# EAGLE design CM FT4232 with RS485 and ESP32 (EAGLE 9.6.2)
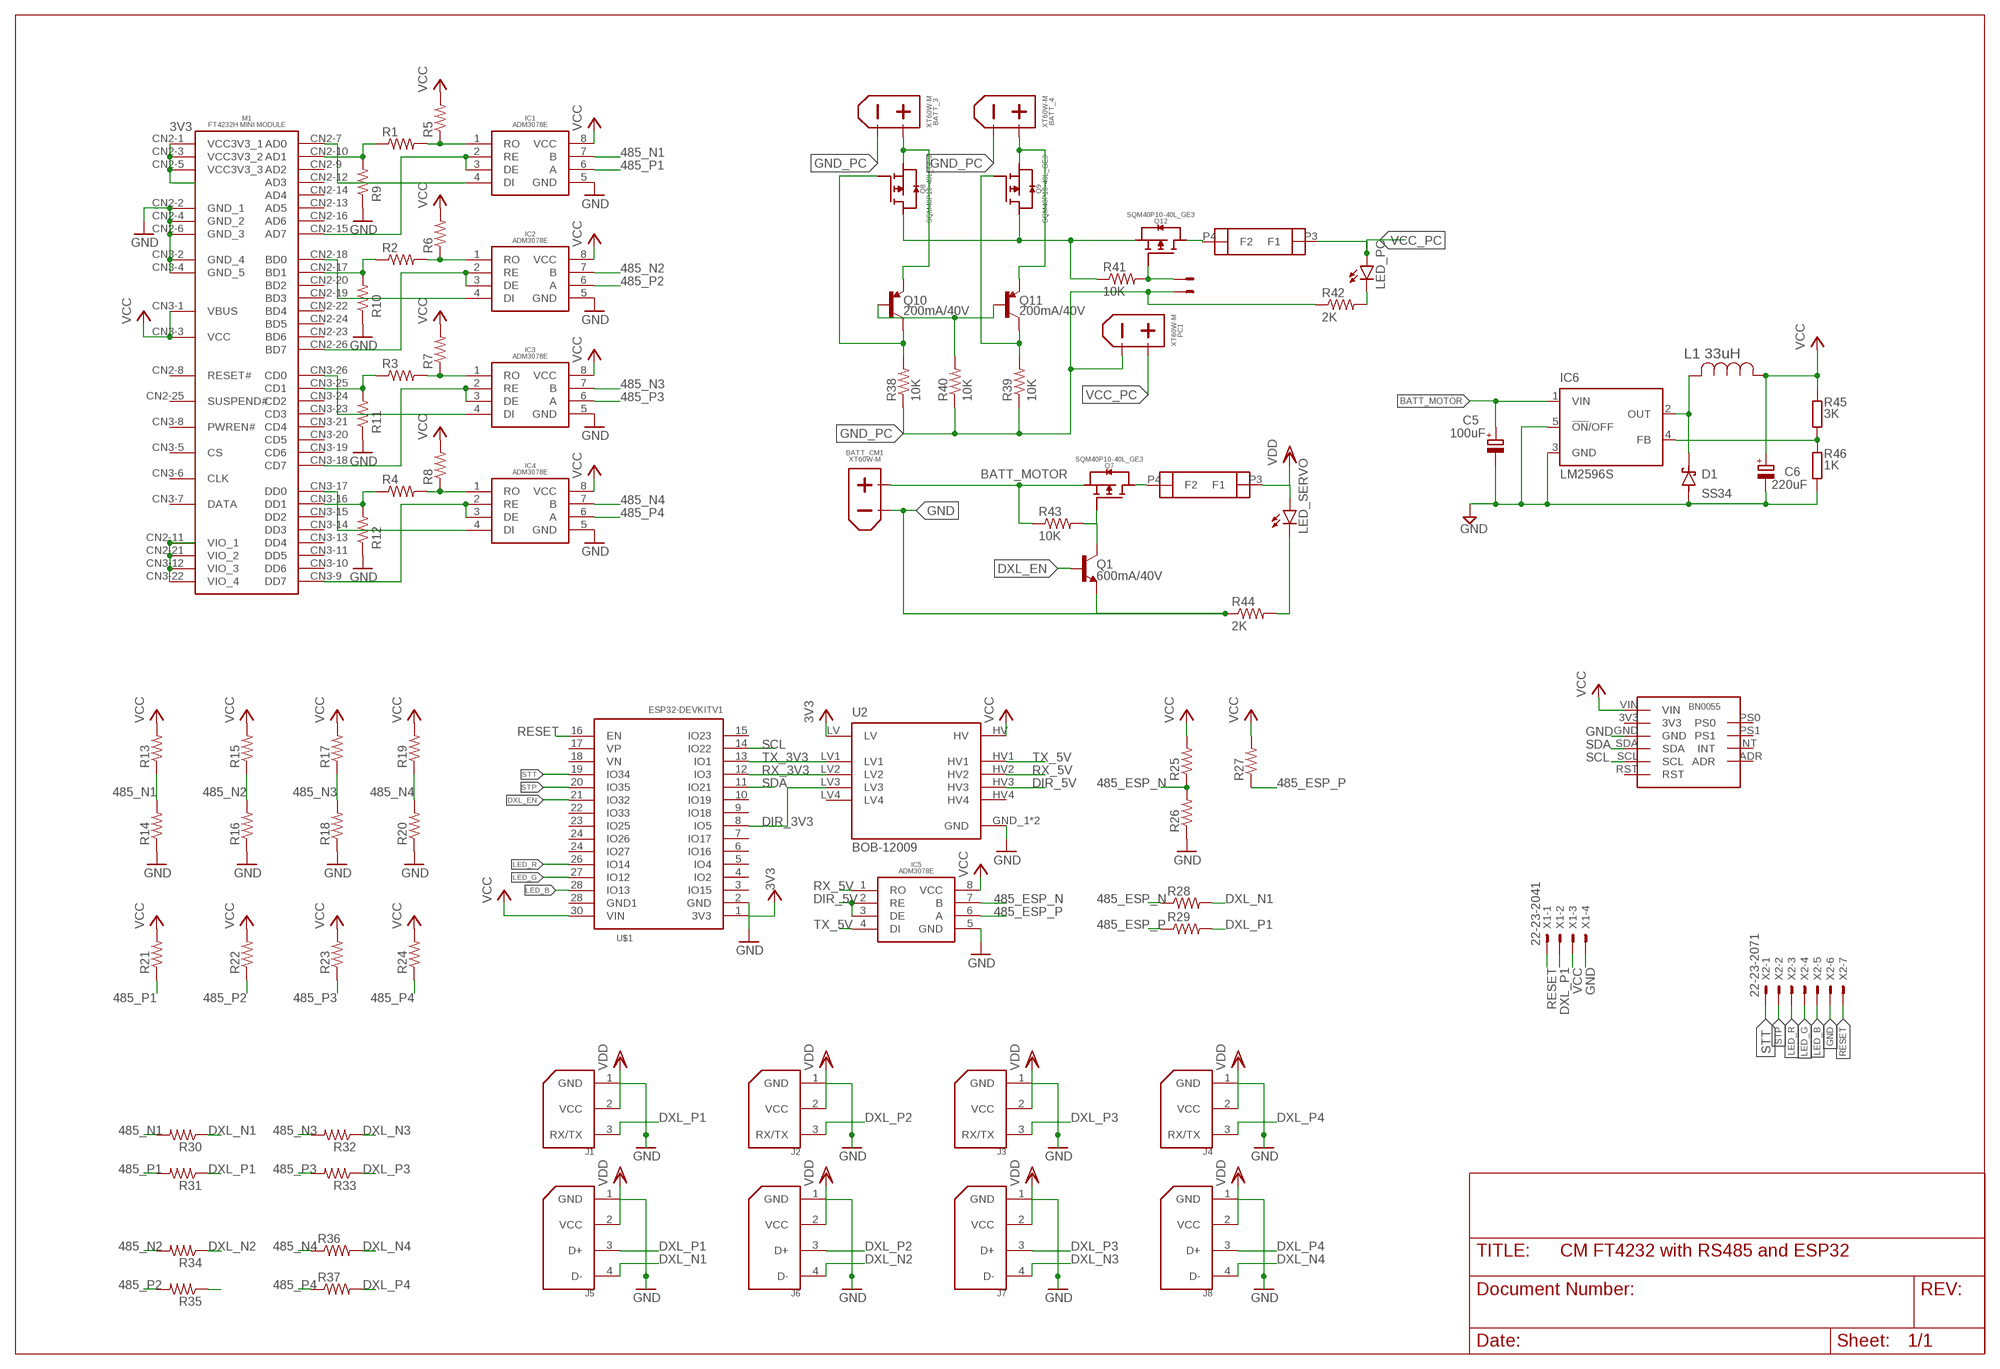
[diagram p0: schematic, sheet 1]

## Parts
BATT_3  XT60PW-M  [XT60PW-M]
BATT_4  XT60PW-M  [XT60PW-M]
BATT_CM1  XT60PW-M  [XT60PW-M]
C5  100uF  CPOL-EU153CLV-1010  [153CLV-1010]
C6  220uF  CPOL-EUUD-6,3X8,8  [UD-6,3X5,8_NICHICON]
D1  SS34  [DIOM6859X262N]
IC1  ADM3078E  [ADM3078E]
IC2  ADM3078E  [ADM3078E]
IC3  ADM3078E  [ADM3078E]
IC4  ADM3078E  [ADM3078E]
IC5  ADM3078E  [ADM3078E]
IC6  LM2596S  [TO263-5]
J1  22-03-5035  [5267-3]
J2  22-03-5035  [5267-3]
J3  22-03-5035  [5267-3]
J4  22-03-5035  [5267-3]
J5  22-03-5045  [5267-4]
J6  22-03-5045  [5267-4]
J7  22-03-5045  [5267-4]
J8  22-03-5045  [5267-4]
L1  33uH  CDRH127/LDNP-470MC  [IND_CDRH127/LDNP-470MC_SUM]
LED_PC  LEDCHIPLED_0805  [CHIPLED_0805]
LED_SERVO  LEDCHIPLED_0805  [CHIPLED_0805]
M1  FT4232H_MINI_MODULE  [FT4232H_MINI_MODULE]
PC1  XT60PW-M  [XT60PW-M]
Q1  600mA/40V  TRANS_NPN-MMBT2222AL  [SOT23-3]
Q7  SQM40P10-40L_GE3  [TO-252-3]
Q8  SQM40P10-40L_GE3  [TO-252-3]
Q9  SQM40P10-40L_GE3  [TO-252-3]
Q10  200mA/40V  TRANS_PNP-PMBT3906|MMBT3906L  [SOT23-3]
Q11  200mA/40V  TRANS_PNP-PMBT3906|MMBT3906L  [SOT23-3]
Q12  SQM40P10-40L_GE3  [TO-252-3]
R1  RESISTOR0805  [0805]
R2  RESISTOR0805  [0805]
R3  RESISTOR0805  [0805]
R4  RESISTOR0805  [0805]
R5  RESISTOR0805  [0805]
R6  RESISTOR0805  [0805]
R7  RESISTOR0805  [0805]
R8  RESISTOR0805  [0805]
R9  RESISTOR0805  [0805]
R10  RESISTOR0805  [0805]
R11  RESISTOR0805  [0805]
R12  RESISTOR0805  [0805]
R13  RESISTOR0805  [0805]
R14  RESISTOR0805  [0805]
R15  RESISTOR0805  [0805]
R16  RESISTOR0805  [0805]
R17  RESISTOR0805  [0805]
R18  RESISTOR0805  [0805]
R19  RESISTOR0805  [0805]
R20  RESISTOR0805  [0805]
R21  RESISTOR0805  [0805]
R22  RESISTOR0805  [0805]
R23  RESISTOR0805  [0805]
R24  RESISTOR0805  [0805]
R25  RESISTOR0805  [0805]
R26  RESISTOR0805  [0805]
R27  RESISTOR0805  [0805]
R28  RESISTOR0805  [0805]
R29  RESISTOR0805  [0805]
R30  RESISTOR0805  [0805]
R31  RESISTOR0805  [0805]
R32  RESISTOR0805  [0805]
R33  RESISTOR0805  [0805]
R34  RESISTOR0805  [0805]
R35  RESISTOR0805  [0805]
R36  RESISTOR0805  [0805]
R37  RESISTOR0805  [0805]
R38  10K  R-US_M0805  [M0805]
R39  10K  R-US_M0805  [M0805]
R40  10K  R-US_M0805  [M0805]
R41  10K  R-US_M0805  [M0805]
R42  2K  R-US_M0805  [M0805]
R43  10K  R-US_M0805  [M0805]
R44  2K  R-US_M0805  [M0805]
R45  3K  R-EU_R1206  [R1206]
R46  1K  R-EU_R1206  [R1206]
U2  BOB-12009  [CONV_BOB-12009]
U$1  ESP32DEVKITV1  [ESP32-DEVKITV1]
U$2  BNO055  [BNO055]
U$3  1808_FUSE_HOLDER  [1808_FUSE_HOLDER]
U$4  1808_FUSE_HOLDER  [1808_FUSE_HOLDER]
X1  22-23-2041  [22-23-2041]
X2  22-23-2071  [22-23-2071]
X8  22-23-2021  [22-23-2021]

## Nets
3V3: M1.CN2-1(VCC3V3_1) M1.CN2-3(VCC3V3_2) M1.CN2-5(VCC3V3_3) M1.CN2-11(VIO_1) M1.CN2-21(VIO_2) M1.CN3-12(VIO_3) M1.CN3-22(VIO_4) U2.LV U$1.1(3V3) ; supply symbol labelled VCC
485_ESP_N: IC5.7(B) R25.1 R26.2 R28.1
485_ESP_P: IC5.6(A) R27.1 R29.1
485_N1: IC1.7(B) R13.1 R14.2 R30.2
485_N2: IC2.7(B) R15.1 R16.2 R34.2
485_N3: IC3.7(B) R17.1 R18.2 R32.2
485_N4: IC4.7(B) R19.1 R20.2 R36.1
485_P1: IC1.6(A) R21.1 R31.2
485_P2: IC2.6(A) R22.1 R35.2
485_P3: IC3.6(A) R23.1 R33.2
485_P4: IC4.6(A) R24.1 R37.1
+3: Q8.4(D) Q9.4(D) Q12.3(S) R41.1
BATT_MOTOR: BATT_CM1.+ C5.+ IC6.1(VIN) Q7.3(S) R43.1
DI1: IC1.4(DI) M1.CN2-7(AD0)
DIR_3V3: U2.LV3 U$1.8(IO5)
DIR_5V: IC5.2(RE) IC5.3(DE) U2.HV3
DRAIN2: Q7.4(D) U$4.P4(F2)
DXL_EN: Q1.1(B) U$1.21(IO32)
DXL_N1: J5.4(D-) R28.2 R30.1
DXL_N2: J6.4(D-) R34.1
DXL_N3: J7.4(D-) R32.1
DXL_N4: J8.4(D-) R36.2
DXL_P1: J1.3(RX/TX) J5.3(D+) R29.2 R31.1 X1.2
DXL_P2: J2.3(RX/TX) J6.3(D+) R35.1
DXL_P3: J3.3(RX/TX) J7.3(D+) R33.1
DXL_P4: J4.3(RX/TX) J8.3(D+) R37.2
GND: BATT_CM1.1(-) BATT_CM1.2(-) BATT_CM1.- C5.- C6.- D1.A IC1.5(GND) IC2.5(GND) IC3.5(GND) IC4.5(GND) IC5.5(GND) IC6.3(GND) IC6.5(!ON!/OFF) J1.1(GND) J2.1(GND) J3.1(GND) J4.1(GND) J5.1(GND) J6.1(GND) J7.1(GND) J8.1(GND) M1.CN2-2(GND_1) M1.CN2-4(GND_2) M1.CN2-6(GND_3) M1.CN3-2(GND_4) M1.CN3-4(GND_5) Q1.2(E) R9.1 R10.1 R11.1 R12.1 R14.1 R16.1 R18.1 R20.1 R26.1 R44.1 R46.1 U2.GND_1(GND) U2.GND_2(GND) U$1.2(GND) U$2.GND X1.4 X2.6
GND_PC: BATT_3.1(-) BATT_3.2(-) BATT_3.- BATT_4.1(-) BATT_4.2(-) BATT_4.- PC1.1(-) PC1.2(-) PC1.- R38.1 R39.1 R40.1 R42.1 X8.2
LED_B: U$1.28(IO13) X2.5
LED_G: U$1.27(IO12) X2.4
LED_R: U$1.26(IO14) X2.3
N$2: IC2.2(RE) IC2.3(DE) M1.CN2-26(BD7)
N$3: IC3.2(RE) IC3.3(DE) M1.CN3-18(CD7)
N$4: IC4.2(RE) IC4.3(DE) M1.CN3-9(DD7)
N$5: M1.CN2-10(AD1) R1.1 R9.2
N$7: M1.CN2-17(BD1) R2.1 R10.2
N$8: IC2.1(RO) R2.2 R6.1
N$9: IC3.1(RO) R3.2 R7.1
N$10: M1.CN3-25(CD1) R3.1 R11.2
N$11: M1.CN3-16(DD1) R4.1 R12.2
N$12: IC4.1(RO) R4.2 R8.1
N$14: IC2.4(DI) M1.CN2-18(BD0)
N$15: IC3.4(DI) M1.CN3-26(CD0)
N$16: IC4.4(DI) M1.CN3-17(DD0)
N$17: BATT_3.+ Q8.3(S) Q10.2(E)
N$18: BATT_4.+ Q9.3(S) Q11.2(E)
N$19: Q8.1(G) Q10.3(C) R38.2
N$20: Q9.1(G) Q11.3(C) R39.2
N$22: Q10.1(B) Q11.1(B) R40.2
N$23: Q12.1(G) R41.2 X8.1
N$24: Q1.3(C) Q7.1(G) R43.2
N$25: LED_PC.C R42.2
N$26: LED_SERVO.C R44.2
N$27: IC6.4(FB) R45.1 R46.2
N$28: D1.C(K) IC6.2(OUT) L1.2
N$29: Q12.4(D) U$3.P4(F2)
RE1: IC1.2(RE) IC1.3(DE) M1.CN2-15(AD7)
RESET: U$1.16(EN) X1.1 X2.7
RO1: IC1.1(RO) R1.2 R5.1
RX_3V3: U2.LV2 U$1.12(IO3)
RX_5V: IC5.1(RO) U2.HV2
SCL: U$1.14(IO22) U$2.SCL
SDA: U$1.11(IO21) U$2.SDA
STP: U$1.20(IO35) X2.2
STT: U$1.19(IO34) X2.1
TX_3V3: U2.LV1 U$1.13(IO1)
TX_5V: IC5.4(DI) U2.HV1
VCC: C6.+ IC1.8(VCC) IC2.8(VCC) IC3.8(VCC) IC4.8(VCC) IC5.8(VCC) L1.1 M1.CN3-1(VBUS) M1.CN3-3(VCC) R5.2 R6.2 R7.2 R8.2 R13.2 R15.2 R17.2 R19.2 R21.2 R22.2 R23.2 R24.2 R25.2 R27.2 R45.2 U2.HV U$1.30(VIN) U$2.VIN X1.3
VCC_PC: LED_PC.A PC1.+ U$3.P3(F1)
VDD: J1.2(VCC) J2.2(VCC) J3.2(VCC) J4.2(VCC) J5.2(VCC) J6.2(VCC) J7.2(VCC) J8.2(VCC) LED_SERVO.A U$4.P3(F1)
Unconnected: M1.CN2-8(RESET#) M1.CN2-9(AD2) M1.CN2-12(AD3) M1.CN2-13(AD5) M1.CN2-14(AD4) M1.CN2-16(AD6) M1.CN2-19(BD3) M1.CN2-20(BD2) M1.CN2-22(BD4) M1.CN2-23(BD6) M1.CN2-24(BD5) M1.CN2-25(SUSPEND#) M1.CN3-5(CS) M1.CN3-6(CLK) M1.CN3-7(DATA) M1.CN3-8(PWREN#) M1.CN3-10(DD6) M1.CN3-11(DD5) M1.CN3-13(DD4) M1.CN3-14(DD3) M1.CN3-15(DD2) M1.CN3-19(CD6) M1.CN3-20(CD5) M1.CN3-21(CD4) M1.CN3-23(CD3) M1.CN3-24(CD2) U2.HV4 U2.LV4 U$1.3(IO15) U$1.4(IO2) U$1.5(IO4) U$1.6(IO16) U$1.7(IO17) U$1.9(IO18) U$1.10(IO19) U$1.15(IO23) U$1.17(VP) U$1.18(VN) U$1.22(IO33) U$1.23(IO25) U$1.24(IO26) U$1.24(IO27) U$1.28(GND1) U$2.3V3 U$2.ADR U$2.INT U$2.PS0 U$2.PS1 U$2.RST

## Library data of the parts
BATT_3 BATT_4 BATT_CM1 PC1 = AMASS_XT60:XT60PW-M
C5 C6 = rcl:CPOL-EU: POLARIZED CAPACITOR, European symbol; SPICEPREFIX: C
D1 = SS34:SS34: Check availability <https://pricing.snapeda.com/parts/SS34/Taiwan%20Semiconductor/view-part?ref=eda>; AVAILABILITY: In Stock; DESCRIPTION: 3A, 40V, Schottky Rectifier; MF: Taiwan Semiconductor; MP: SS34; PACKAGE: SMC-2 Taiwan Semiconductor; PRICE: None; PURCHASE-URL: https://pricing.snapeda.com/search/part/SS34/?ref=eda
IC1-IC5 = ADM3078E:ADM3078E
IC6 = national-semiconductor:LM2596: SIMPLE SWITCHER® Power Converter 150 kHz 3A Step-Down Voltage Regulator Source: http://www.national.com/ds/LM/LM2596.pdf; MF: NATIONAL SEMICONDUCTOR; MPN: LM2596S-ADJ/NOPB; OC_FARNELL: 9494367; OC_NEWARK: 41K3842
J1-J4 = molex:22-03-5035: Molex SPOX Vert, Tin (Dynamixel AX/MX Bus) tested: YES (arbotix)
J5-J8 = molex:22-03-5045: Molex SPOX Vert, Tin (Dynamixel RX Bus) tested: YES (arbotix2)
L1 = CDRH127_LDNP-470MC:CDRH127/LDNP-470MC: Check availability <https://pricing.snapeda.com/parts/CDRH127/LDNP-470MC/Sumida%20America/view-part?ref=eda>; AVAILABILITY: In Stock; DESCRIPTION: 47 µH Shielded - Inductor 3.25 A 78mOhm Max Nonstandard; MF: Sumida America; MP: CDRH127/LDNP-470MC; PACKAGE: Nonstandard Sumida; PRICE: None; PURCHASE-URL: https://pricing.snapeda.com/search/part/CDRH127/LDNP-470MC/?ref=eda
LED_PC LED_SERVO = led:LED: LED OSRAM: - CHIPLED LG R971, LG N971, LY N971, LG Q971, LY Q971, LO R971, LY R971 LH N974, LH R974 LS Q976, LO Q976, LY Q976 LO Q996 - Hyper CHIPLED LW Q18S LB Q993, LB Q99A, LB R99A - SideLED LS A670, LO A670, LY A670, LG A670, LP A670 LB A673, LV A673, LT A673, LW A673 LH A674 LY A675 LS A676, LA A676, LO A676, LY A676, LW A676 LS A679, LY A679, LG A679 - Hyper Micro SIDELED® LS Y876, LA Y876, LO Y876, LY Y876 LT Y87S - SmartLED LW L88C, LW L88S LB L89C, LB L89S, LG L890 LS L89K, LO L89K, LY L89K LS L896, LA L896, LO L896, LY L896 - TOPLED LS T670, LO T670, LY T670, LG T670, LP T670 LSG T670, LSP T670, LSY T670, LOP T670, LYG T670 LG T671, LOG T671, LSG T671 LB T673, LV T673, LT T673, LW T673 LH T674 LS T676, LA T676, LO T676, LY T676, LB T676, LH T676, LSB T676, LW T676 LB T67C, LV T67C, LT T67C, LS T67K, LO T67K, LY T67K, LW E67C LS E67B, LA E67B, LO E67B, LY E67B, LB E67C, LV E67C, LT E67C LW T67C LS T679, LY T679, LG T679 LS T770, LO T770, LY T770, LG T770, LP T770 LB T773, LV T773, LT T773, LW T773 LH T774 LS E675, LA E675, LY E675, LS T675 LS T776, LA T776, LO T776, LY T776, LB T776 LHGB T686 LT T68C, LB T68C - Hyper Mini TOPLED® LB M676 - Mini TOPLED Santana® LG M470 LS M47K, LO M47K, LY M47K Source: http://www.osram.convergy.de LUXEON: - LUMILED® LXK2-PW12-R00, LXK2-PW12-S00, LXK2-PW14-U00, LXK2-PW14-V00 LXK2-PM12-R00, LXK2-PM12-S00, LXK2-PM14-U00 LXK2-PE12-Q00, LXK2-PE12-R00, LXK2-PE12-S00, LXK2-PE14-T00, LXK2-PE14-U00 LXK2-PB12-K00, LXK2-PB12-L00, LXK2-PB12-M00, LXK2-PB14-N00, LXK2-PB14-P00, LXK2-PB14-Q00 LXK2-PR12-L00, LXK2-PR12-M00, LXK2-PR14-Q00, LXK2-PR14-R00 LXK2-PD12-Q00, LXK2-PD12-R00, LXK2-PD12-S00 LXK2-PH12-R00, LXK2-PH12-S00 LXK2-PL12-P00, LXK2-PL12-Q00, LXK2-PL12-R00 Source: www.luxeon.com KINGBRIGHT: KA-3528ASYC Source: www.kingbright.com
M1 = FT4232H_MINI_MODULE:FT4232H_MINI_MODULE
Q1 = SparkFun-DiscreteSemi:TRANS_NPN: NPN transistor Current controlled devices typically used to amplify current or used as a switch. BC547 - COM-08928 <http://www.sparkfun.com/products/8928> (TO-92 45V 100mA) (1.Collector 2.Base 3.Emitter) 2N3904 - COM-00521 <http://www.sparkfun.com/products/521> (TO-92 40V 200mA) (1.Emitter 2.Base 3.Collector) P2N2222A - COM-12852 <http://www.sparkfun.com/products/12852> (TO-92 40V 600mA) (1.Collector 2.Base 3.Emitter); PROD_ID: TRANS-08049
Q7-Q9 Q12 = Vishay_FET:SQM40P10-40L_GE3
Q10 Q11 = SparkFun-DiscreteSemi:TRANS_PNP: PNP transistor Current controlled devices typically used to amplify current or used as a switch. SparkFun Products: SparkFun Serial Enabled 16x2 LCD - Red on Black <https://www.sparkfun.com/products/9068> SparkFun Logomatic <https://www.sparkfun.com/products/12772>; PROD_ID: TRANS-08052
R1-R37 = SparkFun-Resistors:RESISTOR: Generic Resistor Package
R38-R44 = rcl:R-US_: RESISTOR, American symbol; SPICEPREFIX: R
R45 R46 = rcl:R-EU_: RESISTOR, European symbol; SPICEPREFIX: R
U2 = BOB-12009:BOB-12009: Logic Level Converter - Bi-Direc Check availability <https://pricing.snapeda.com/parts/BOB-12009/SparkFun/view-part?ref=eda>; AVAILABILITY: In Stock; DESCRIPTION: BSS138 Logic-Level Translator Interface Evaluation Board; MF: SparkFun; MP: BOB-12009; PACKAGE: None; PRICE: None; PURCHASE-URL: https://pricing.snapeda.com/search/part/BOB-12009/?ref=eda
U$1 = ESP32-DEVKITV1:ESP32DEVKITV1
U$2 = BNO055:BNO055
U$3 U$4 = 1808_Fuse_Holder:1808_FUSE_HOLDER
X1 = con-molex:22-23-2041: .100" (2.54mm) Center Header - 4 Pin; MF: MOLEX; MPN: 22-23-2041; OC_FARNELL: 1462920; OC_NEWARK: 38C0355
X2 = con-molex:22-23-2071: .100" (2.54mm) Center Header - 7 Pin; MF: MOLEX; MPN: 22-23-2071; OC_FARNELL: 1654534; OC_NEWARK: 56H0445
X8 = con-molex:22-23-2021: .100" (2.54mm) Center Header - 2 Pin; MF: MOLEX; MPN: 22-23-2021; OC_FARNELL: 1462926; OC_NEWARK: 25C3832

## Net classes
4 Battery-Power: width 2.54 mm, drill 1.27 mm, clearance 0.203 mm

## Board
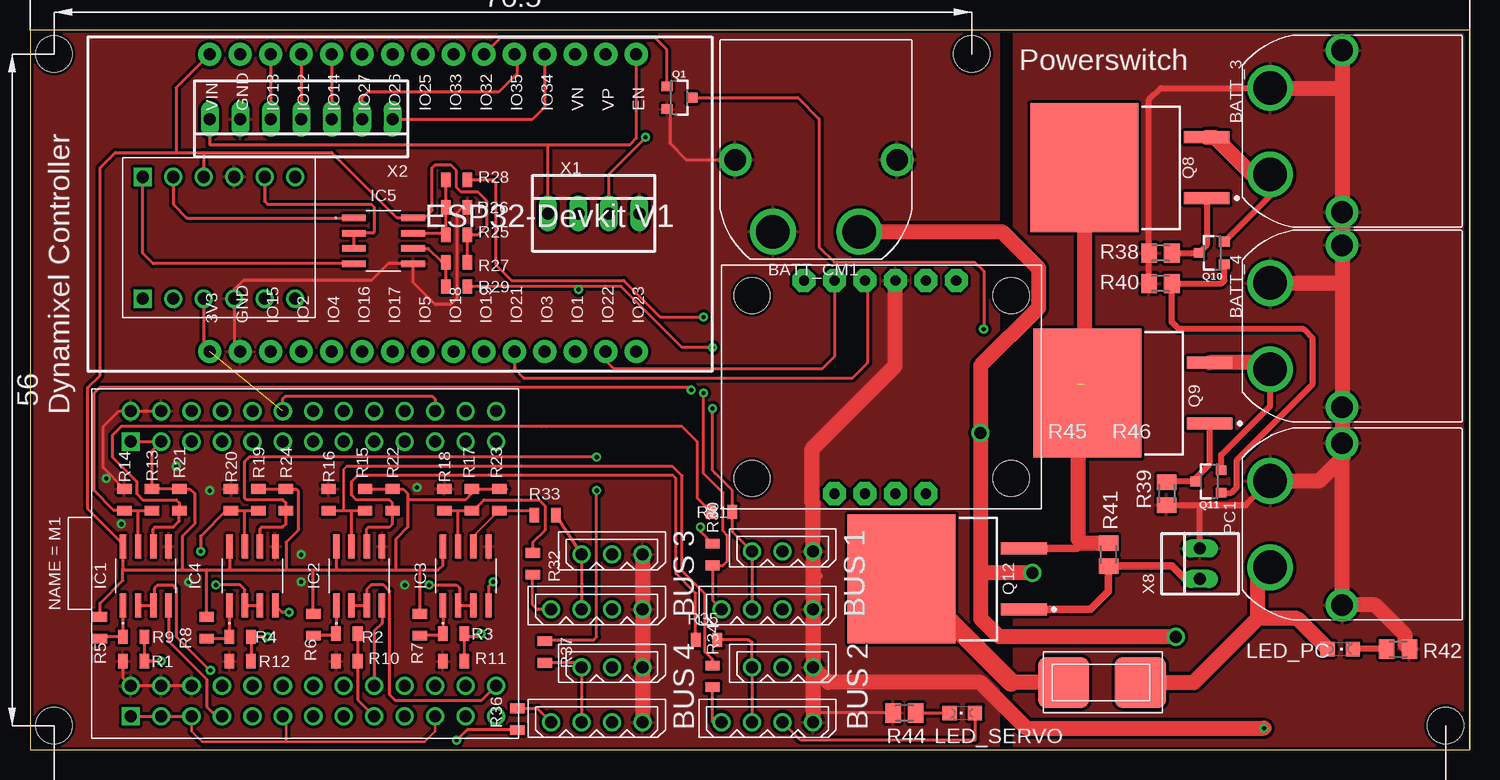
[diagram p1: board, top side]
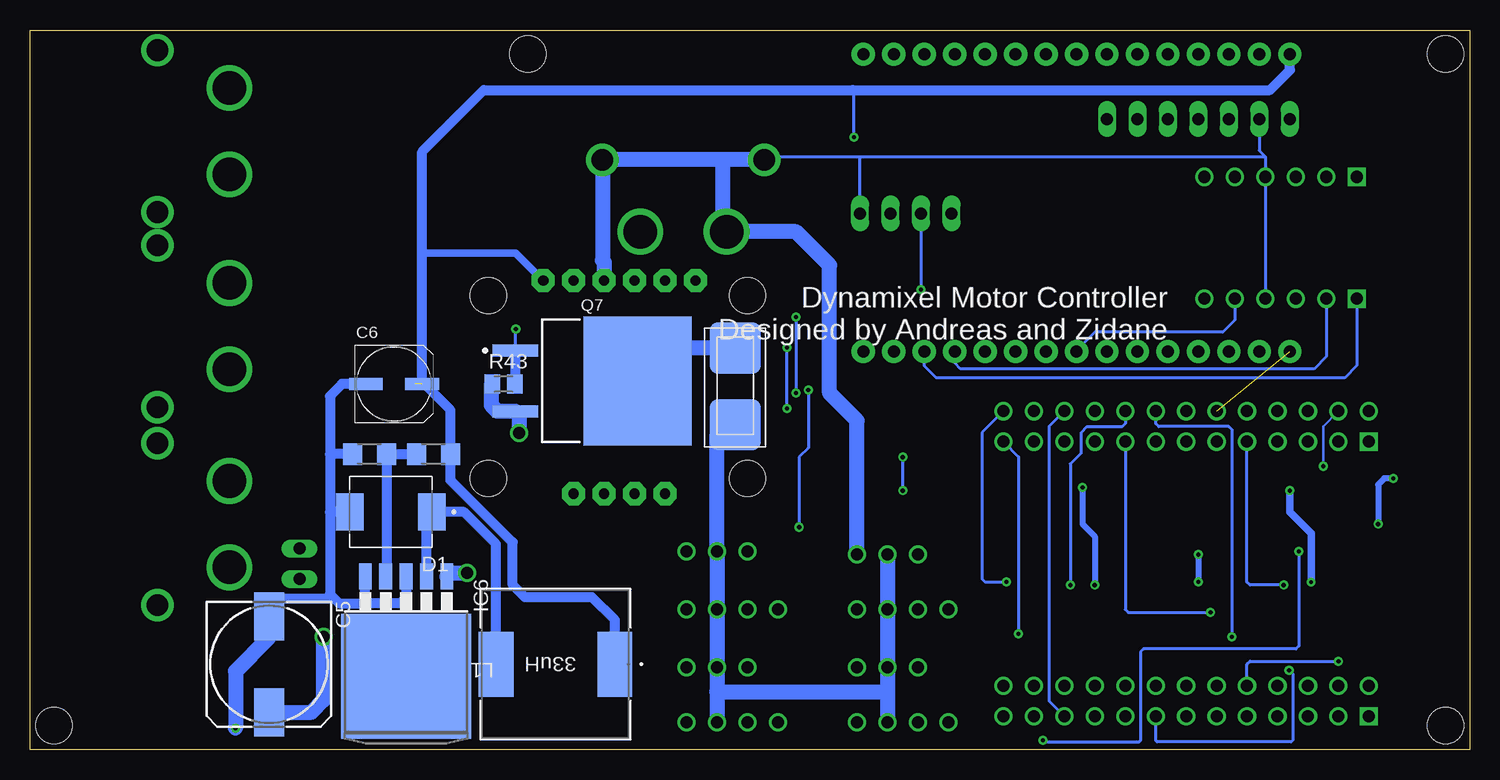
[diagram p2: board, bottom side, seen from below]

Size 120 x 60 mm. Coordinates in mm from the lower left corner, seen from the top.
Outline: 0,0 120,0 120,60 0,60 0,0
Copper layers (1*16): Top 0.035mm / dielectric 1.5mm / Bottom 0.035mm
Design rules "default *": minimum track width 6mil, minimum drill 0.35mm, track to track 10mil, track to pad 10mil, pad to pad 10mil, via to via 10mil, smd to smd 10mil, copper to edge 10mil, drill to drill 6mil, minimum pad ring 10mil, minimum via ring 8mil, stop-mask expansion 4mil, vias tented up to drill 0mil, thermal gap 10mil
Holes 3 mm at 118,2 2,2 2,58 78.5,58

### Footprints (pad centres in the part's own frame; a part is rotated, then mirrored left to right if it is on the bottom)
XT60PW-M = drill 1.8: 1 -6.75,-10; 2 6.75,-10 | drill 2.8: + 3.6,-16; - -3.6,-16
153CLV-1010 = smd 4 x 2.5: + 4,0; - -4,0
UD-6,3X5,8_NICHICON = smd 2.8 x 1: + 2.35,0; - -2.35,0
DIOM6859X262N = smd 2.29 x 3.12: A 3.43,0; C -3.43,0
ADM3078E = smd 1.981 x 0.533: 1 -2.464,1.905; 2 -2.464,0.635; 3 -2.464,-0.635; 4 -2.464,-1.905; 5 2.464,-1.905; 6 2.464,-0.635; 7 2.464,0.635; 8 2.464,1.905
TO263-5 = smd 1.067 x 2.159: 1 -3.404,-5.791; 2 -1.702,-5.791; 3 0,-5.791; 4 1.702,-5.791; 5 3.404,-5.791 | smd 10.8 x 10.41: 6 0,2.54
5267-3 = drill 1: 1 0,0; 2 -2.54,0; 3 -5.08,0
5267-4 = drill 1: 1 0,0; 2 -2.54,0; 3 -5.08,0; 4 -7.62,0
IND_CDRH127/LDNP-470MC_SUM = smd 2.896 x 5.41: 1 -4.953,0; 2 4.953,0
CHIPLED_0805 = smd 1.2 x 1.2: A 0,-1.05; C 0,1.05
FT4232H_MINI_MODULE = drill 1 square: CN2-1 -12.715,16.51; CN3-1 10.175,16.51 | drill 1: CN2-2 -10.175,16.51; CN2-3 -12.715,13.97; CN2-4 -10.175,13.97; CN2-5 -12.715,11.43; CN2-6 -10.175,11.43; CN2-7 -12.715,8.89; CN2-8 -10.175,8.89; CN2-9 -12.715,6.35; CN2-10 -10.175,6.35; CN2-11 -12.715,3.81; CN2-12 -10.175,3.81; CN2-13 -12.715,1.27; CN2-14 -10.175,1.27; CN2-15 -12.715,-1.27; CN2-16 -10.175,-1.27; CN2-17 -12.715,-3.81; CN2-18 -10.175,-3.81; CN2-19 -12.715,-6.35; CN2-20 -10.175,-6.35; CN2-21 -12.715,-8.89; CN2-22 -10.175,-8.89; CN2-23 -12.715,-11.43; CN2-24 -10.175,-11.43; CN2-25 -12.715,-13.97; CN2-26 -10.175,-13.97; CN3-2 12.715,16.5; CN3-3 10.175,13.97; CN3-4 12.715,13.97; CN3-5 10.175,11.43; CN3-6 12.715,11.43; CN3-7 10.175,8.89; CN3-8 12.715,8.89; CN3-9 10.175,6.35; CN3-10 12.715,6.35; CN3-11 10.175,3.81; CN3-12 12.715,3.81; CN3-13 10.175,1.27; CN3-14 12.715,1.27; CN3-15 10.175,-1.27; CN3-16 12.715,-1.27; CN3-17 10.175,-3.81; CN3-18 12.715,-3.81; CN3-19 10.175,-6.35; CN3-20 12.715,-6.35; CN3-21 10.175,-8.89; CN3-22 12.715,-8.89; CN3-23 10.175,-11.43; CN3-24 12.715,-11.43; CN3-25 10.175,-13.97; CN3-26 12.715,-13.97
SOT23-3 = smd 0.8 x 0.9: 1 -0.95,-1; 2 0.95,-1; 3 0,1.1
TO-252-3 = smd 3.8 x 1: 1 -6.4,2.54; 3 -6.4,-2.54 | smd 9 x 10.75: 4 3.8,0
0805 = smd 0.8 x 1.2: 1 -0.9,0; 2 0.9,0
M0805 = smd 1.3 x 1.6: 1 -0.95,0; 2 0.95,0
R1206 = smd 1.6 x 1.803: 1 -1.422,0; 2 1.422,0
CONV_BOB-12009 = drill 1.016: GND_1 5.08,-1.27; GND_2 -5.08,-1.27; HV 5.08,1.27; HV2 5.08,3.81; HV3 5.08,-3.81; HV4 5.08,-6.35; LV -5.08,1.27; LV2 -5.08,3.81; LV3 -5.08,-3.81; LV4 -5.08,-6.35 | drill 1.016 square: HV1 5.08,6.35; LV1 -5.08,6.35
ESP32-DEVKITV1 = drill 1 pad 1.93: 1 -22.87,-13.54; 2 -20.33,-13.54; 3 -17.79,-13.54; 4 -15.25,-13.54; 5 -12.71,-13.54; 6 -10.17,-13.54; 7 -7.63,-13.54; 8 -5.09,-13.54; 9 -2.55,-13.54; 10 -0.01,-13.54; 11 2.53,-13.54; 12 5.07,-13.54; 13 7.61,-13.54; 14 10.15,-13.54; 15 12.69,-13.54; 16 12.69,11.23; 17 10.15,11.23; 18 7.61,11.23; 19 5.07,11.23; 20 2.53,11.23; 21 -0.01,11.23; 22 -2.55,11.23; 23 -5.09,11.23; 24 -7.63,11.23; 25 -10.17,11.23; 26 -12.71,11.23; 27 -15.25,11.23; 28 -17.79,11.23; 29 -20.33,11.23; 30 -22.87,11.23
BNO055 = drill 0.85 pad 1.93 octagon: 3V3 9.652,1.27; ADR 17.272,19.05; GND 12.192,1.27; INT 14.732,19.05; PS0 9.652,19.05; PS1 12.192,19.05; RST 19.812,1.27; SCL 17.272,1.27; SDA 14.732,1.27; VIN 7.112,1.27 | hole 3: 2.54,2.54; 2.54,17.78; 24.13,2.54; 24.13,17.78
1808_FUSE_HOLDER = smd 4.242 x 4.242: P3 -3.15,0; P4 3.251,0
22-23-2041 = drill 1 long: 1 -3.81,0; 2 -1.27,0; 3 1.27,0; 4 3.81,0
22-23-2071 = drill 1 long: 1 -7.62,0; 2 -5.08,0; 3 -2.54,0; 4 0,0; 5 2.54,0; 6 5.08,0; 7 7.62,0
22-23-2021 = drill 1 long: 1 -1.27,0; 2 1.27,0

### Placement (x,y rotation side)
BATT_3  119.38,51.56 270 top
BATT_4  119.38,35.31 270 top
BATT_CM1  65.53,59.18 0 top
C5  100.08,7.11 270 bottom
C6  89.66,30.48 0 bottom
D1  89.92,19.81 180 bottom
IC1  9.65,14.48 90 top
IC2  27.43,14.48 90 top
IC3  36.32,14.48 90 top
IC4  18.54,14.48 90 top
IC5  29.46,42.42 0 top
IC6  88.65,8.64 180 bottom
J1  65.28,16.51 0 top
J2  65.28,6.86 0 top
J3  51.05,16.26 0 top
J4  51.05,6.86 0 top
J5  65.28,11.68 0 top
J6  65.28,2.29 0 top
J7  51.05,11.68 0 top
J8  51.05,2.29 0 top
L1  76.2,7.11 180 bottom
LED_PC  109.22,8.38 270 top
LED_SERVO  77.72,3.05 90 top
M1  24.89,15.49 90 top
PC1  119.38,18.8 270 top
Q1  54.1,54.36 270 top
Q7  73.15,30.73 0 bottom
Q8  91.69,48.51 180 top
Q9  91.95,29.72 180 top
Q10  98.55,41.4 90 top
Q11  98.3,22.35 90 top
Q12  76.45,14.22 180 top
R1  8.64,9.4 180 top
R2  26.42,9.65 180 top
R3  35.31,9.65 180 top
R4  17.53,9.4 180 top
R5  5.84,10.16 90 top
R6  23.62,10.41 90 top
R7  32.51,10.41 90 top
R8  14.73,10.16 90 top
R9  8.64,7.37 0 top
R10  26.42,7.37 0 top
R11  35.31,7.37 0 top
R12  17.53,7.37 0 top
R13  10.16,20.83 90 top
R14  7.87,20.83 270 top
R15  27.94,20.83 90 top
R16  24.89,20.83 270 top
R17  36.83,20.83 90 top
R18  34.54,20.83 270 top
R19  19.05,20.83 90 top
R20  16.76,20.83 270 top
R21  12.45,20.83 90 top
R22  30.23,20.83 90 top
R23  39.12,20.83 90 top
R24  21.34,20.83 90 top
R25  35.56,42.93 0 top
R26  35.56,45.21 180 top
R27  35.56,40.64 0 top
R28  35.56,47.5 0 top
R29  35.56,38.61 0 top
R30  56.9,16.26 90 top
R31  57.66,19.81 180 top
R32  41.91,15.49 90 top
R33  42.93,19.56 180 top
R34  56.9,6.1 90 top
R35  56.39,9.14 180 top
R36  40.64,2.54 90 top
R37  42.93,8.13 270 top
R38  94.23,41.4 0 top
R39  94.74,21.34 90 top
R40  94.23,38.86 0 top
R41  89.92,16.26 270 top
R42  114.05,8.38 180 top
R43  80.52,30.48 0 bottom
R44  72.9,3.05 0 top
R45  86.36,24.64 0 bottom
R46  91.69,24.64 0 bottom
U2  15.75,42.67 90 top
U$1  37.85,46.74 0 top
U$2  84.33,40.39 180 top
U$3  89.41,5.59 180 top
U$4  61.21,30.23 90 bottom
X1  46.99,44.7 0 top
X2  22.61,52.58 180 top
X8  97.54,15.49 90 top

### Tracks (layer width: path | path; a pad name or v marks a point on that pad's centre or on a via)
3V3  (1 unrouted)
  Top 0.203: M1.CN2-5 13.46,1.52 14.35,0.64 21.34,0.64 | 21.34,0.64 32.89,0.64 33.78,1.52 M1.CN2-21 | M1.CN2-11 21.34,2.52 21.34,0.64
  Top 0.254: M1.CN2-1 M1.CN2-3 M1.CN2-5 | M1.CN3-12 21.08,29.21 21.34,29.46 33.53,29.46 33.78,29.21 M1.CN3-22 | U$1.1 14.47,33.7 14.47,37.58 U2.LV
  Bottom 0.254: M1.CN3-22 35.05,26.94 35.05,4.05 M1.CN2-21
485_ESP_N
  Top 0.254: 34.66,43.05 R25.1 | IC5.7 34.66,43.05 | R28.1 R26.2 34.66,43.05
485_ESP_P
  Top 0.254: IC5.6 33.2,41.78 34.34,40.64 R27.1 R29.1
485_N1  (via drill 0.35)
  Top 0.254: 8.89,19.93 R14.2 7,19.93 5.33,21.59 5.33,29.72 5.84,30.23 54.86,30.23 v55.12,29.97 | 8.89,19.93 R13.1 | IC1.7 9.02,19.8 8.89,19.93 | v55.88,18.54 55.88,18.17 R30.2
  Bottom 0.254: v55.12,29.97 55.12,25.15 55.88,24.38 v55.88,18.54
485_N2
  Top 0.203: 26.16,19.93 26.16,23.37 26.42,23.62
  Top 0.254: R16.2 26.16,19.93 26.92,19.93 | 26.92,19.93 R15.1 | IC2.7 26.8,19.8 26.92,19.93 | R34.2 56.9,7.5 56.27,8.13 56.27,12.97 54.36,14.88 54.36,22.81 53.55,23.62 26.42,23.62
485_N3
  Top 0.254: R18.2 35.81,19.93 | 35.81,19.93 R17.1 36.95,19.93 37.85,20.83 42.42,20.83 42.93,20.32 42.93,18.29 41.91,17.27 R32.2 | IC3.7 35.69,19.8 35.81,19.93
485_N4  (via drill 0.35)
  Top 0.254: 18.03,19.93 R20.2 16.37,19.93 14.22,17.78 v14.22,16.51 | 18.03,19.93 R19.1 | IC4.7 17.91,19.8 18.03,19.93 | R36.1 36.44,1.64 v35.56,0.76
  Bottom 0.254: v14.22,16.51 14.22,8.64 14.48,8.38 27.18,8.38 27.43,8.13 27.43,0.76 27.56,0.64 35.43,0.64 v35.56,0.76
485_P1
  Top 0.254: IC1.6 10.29,18.41 10.41,18.54 11.94,18.54 12.45,19.05 R21.1 12.45,20.57 12.19,20.83 9.4,20.83 8.89,21.34 8.89,22.35 6.86,24.38 6.86,26.19 7.59,26.92 42.67,26.92 43.02,26.92 54.36,26.92 55.63,25.65 55.63,20.94 R31.2
485_P2
  Top 0.254: IC2.6 28.07,18.41 28.19,18.54 29.97,18.54 30.23,18.8 R22.1 30.23,20.57 29.97,20.83 27.18,20.83 26.8,21.21 26.8,22.35 27.3,22.86 53.59,22.86 53.85,22.6 53.85,14.67 55.49,13.03 R35.2
485_P3
  Top 0.203: IC3.6 36.96,17.77 R23.1
  Top 0.254: R23.1 41.66,19.93 R33.2
485_P4  (via drill 0.35)
  Top 0.254: IC4.6 19.18,18.41 19.3,18.54 21.08,18.54 21.34,18.8 R24.1 21.34,20.57 21.08,20.83 18.03,20.83 17.91,20.95 17.91,24 18.16,24.26 18.29,24.38 v47.24,24.38 | R37.1 43.04,9.14 46.99,9.14 47.24,9.4 v47.24,21.59
  Bottom 0.254: v47.24,21.59 v47.24,24.38
+3
  Top 0.152: Q9.4 87.88,29.72 87.38,30.23
  Top 0.61: Q12.3 87.25,16.76 87.7,17.21
  Top 1.27: Q8.4 87.89,31.24 | 87.89,31.24 87.89,29.97 Q9.4 | 87.89,31.24 88.15,31.5 88.65,31.5 87.38,30.23 87.38,17.53 87.7,17.21 R41.1
BATT_MOTOR  (via drill 1)
  Top 1.27: v95.5,9.4 80.77,9.4 79.25,10.92 79.25,14.73 | 79.25,14.73 v79.25,26.42 79.25,32 84.07,36.83 84.07,40.13 81.02,43.18 BATT_CM1.+ | v83.57,14.73 79.25,14.73
  Bottom 1.27: C5.+ 96.52,3.11 95.5,4.13 v95.5,9.4 | IC6.1 84.94,14.73 v83.57,14.73 | v79.25,26.42 79.25,27.89 Q7.3 81.03,28.19 81.53,28.7 81.53,30.41 R43.1
DI1
  Top 0.254: IC1.4 11.56,9.02 14.73,5.84 14.73,3.56 15.51,2.78 M1.CN2-7
DIR_3V3
  Bottom 0.254: U2.LV3 19.56,35.81 20.57,34.8 31.24,34.8 32.76,33.28 U$1.8
DIR_5V
  Top 0.254: U2.HV3 19.56,45.72 19.81,45.47 28.45,45.47 28.7,45.21 28.7,43.18 28.57,43.05 IC5.2 IC5.3
DRAIN2
  Bottom 1.27: U$4.P4 65.84,33.48 69.09,30.23 69.35,30.49 Q7.4
DXL_EN
  Top 0.254: Q1.1 53.1,58.35 52.09,59.37 39.24,59.37 U$1.21
DXL_N1  (via drill 0.35)
  Top 0.254: J5.4 56.9,12.45 R30.1 57.77,15.36 58.17,15.75 58.17,17.82 57.78,18.21 57.78,21.4 56.14,23.04 v56.14,29.72 | R28.2 38.61,47.5 38.86,47.24 38.86,40.39 40.13,39.12 49.49,39.12 52.53,36.07 v56.13,36.07
  Bottom 0.254: v56.13,36.07 v56.13,29.72 v56.14,29.72
DXL_N2
  Top 0.254: J6.4 56.9,2.29 R34.1
DXL_N3
  Top 0.254: J7.4 42.28,11.68 41.91,12.05 R32.1
DXL_N4
  Top 0.254: R36.2 42.28,3.44 J8.4
DXL_P1  (via drill 0.35)
  Top 0.254: J5.3 J1.3 58.56,18.15 R31.1 58.56,21.59 57.09,23.06 56.9,23.25 v56.9,28.45 | 45.72,38.61 49.28,38.61 54.36,33.53 v56.9,33.53 | 45.72,38.61 R29.2 | v45.72,38.36 45.72,38.61
  Bottom 0.254: v56.9,28.45 v56.9,33.53 | X1.2 v45.72,38.36
DXL_P2
  Top 0.254: R35.1 59.81,9.14 60.2,8.95 J2.3 J6.3
DXL_P3
  Top 0.254: R33.1 J3.3 J7.3
DXL_P4
  Top 0.254: R37.2 45.6,7.23 J4.3 J8.3
GND  (via drill 0.3, 0.35)
  Top 0.254: M1.CN2-6 M1.CN2-4 M1.CN2-2 7.74,5.96 R9.1 | M1.CN3-4 M1.CN3-2 7.38,28.21 6.1,26.92 6.1,23.51 R14.1 | 17.01,37.58 17.01,33.7 U$1.2 | 17.01,37.58 U2.GND_2 | 17.01,37.58 17.01,38.34 17.78,39.12 28.45,39.12 29.84,40.51 IC5.5 31.93,38.94 33.78,37.08 35.05,37.08 35.56,37.59 35.56,44.7 36.07,45.21 R26.1 | Q1.2 53.34,53.17 53.34,50.55 54.7,49.18 BATT_CM1.1 | R44.1 65.53,3.05 65.28,3.3
  Top 0.61: 65.79,14.48 65.28,13.97
  Top 1.27: J2.1 J5.1 65.28,13.97 J1.1 65.28,20.49 65.2,20.57 65.2,25.07 72.14,32 U$2.GND | J2.1 65.28,3.3 J6.1 | J3.1 J7.1 J4.1 J8.1 | J2.1 66.55,5.59 79.25,5.59 83.06,1.78 v102.87,1.78
  Bottom 0.203: M1.CN3-4 12.19,26.94 v12.19,23.62
  Bottom 0.254: U2.GND_2 U2.GND_1 17.02,49.44 | 50.8,49.44 58.53,49.44 BATT_CM1.1 | 50.8,49.44 17.02,49.44 | X2.6 17.53,49.94 17.02,49.44 | X1.4 50.8,49.44
  Bottom 0.508: v22.61,16.26 v22.61,13.97 | v32.26,21.84 32.26,18.8 31.24,17.78 v31.24,13.72 | v6.35,22.61 7.11,22.61 7.62,22.1 v7.62,18.8
  Bottom 0.61: BATT_CM1.2 72.28,49.02 | 72.28,39.26 U$2.GND | v14.99,21.59 14.99,19.81 13.21,18.03 v13.21,13.97
  Bottom 0.813: IC6.3 88.65,12.7 89.15,12.19 91.95,12.19 | 91.95,12.19 92.05,12.29 IC6.5 | C6.- 93.98,30.48 95,29.46 95,24.64 | 91.95,12.19 94.23,12.19 94.61,12.57 | 95,24.64 95,19.81 | 95,19.81 95,12.95 94.61,12.57 | 94.61,12.57 99.69,12.57 100.33,11.94 100.33,11.37 C5.- | D1.A 95,19.81 | R46.1 95,24.64
  Bottom 1.27: BATT_CM1.1 62.23,49.18 | 62.23,49.18 72.12,49.18 72.28,49.02 | 62.23,49.18 62.23,43.48 BATT_CM1.- 56.14,43.18 53.34,40.39 53.34,29.72 51.05,27.43 J3.1 | BATT_CM1.2 72.28,40.79 72.14,40.64 72.14,39.41 72.28,39.26 | C5.- 100.08,9.33 102.87,6.54 v102.87,1.78
  pour Top: 0,59.94 80.77,59.94 80.77,0.25 0,0.25
GND_PC
  Top 0.508: R39.1 97.54,20.39 | 97.54,20.39 101.37,20.39 PC1.- | X8.2 97.54,20.39 | R40.1 R38.1 93.28,54.17 94.28,55.16 BATT_3.-
  Top 1.27: BATT_3.1 109.38,55.12 | 109.38,55.12 BATT_3.2 BATT_4.1 109.38,38.61 | 109.38,38.61 BATT_4.2 PC1.1 | PC1.- 107.49,22.4 109.47,24.38 109.47,25.15 109.38,25.24 PC1.1 | BATT_4.- 109.08,38.91 109.38,38.61 | BATT_3.- 109.34,55.16 109.38,55.12 | R42.1 114.64,8.74 114.64,9.55 112.14,12.05 PC1.2 PC1.1
  pour Top: 82.04,59.69 119.38,59.69 119.38,-0.25 82.04,-0.25
LED_B
  Top 0.254: U$1.28 20.07,57.96 X2.5
LED_G
  Top 0.254: U$1.27 22.6,52.59 X2.4
LED_R
  Top 0.254: U$1.26 25.14,52.59 X2.3
N$2
  Top 0.254: IC2.2 IC2.3 28.07,13.34 28.45,13.72 29.46,13.72 29.98,13.2 29.98,10.87 29.97,10.85 29.97,4.57 30.48,4.06 37.61,4.06 M1.CN2-26
N$3  (via drill 0.35)
  Top 0.254: IC3.2 35.81,12.01 | 35.81,12.01 IC3.3 | v33.27,13.72 35.56,13.72 35.81,13.46 35.81,12.01
  Bottom 0.254: M1.CN3-18 28.7,27.18 28.96,26.92 31.89,26.92 32.39,26.42 32.39,24.69 33.27,23.81 v33.27,13.72
N$4  (via drill 0.35)
  Top 0.254: IC4.3 IC4.2 17.91,13.34 17.53,13.72 v15.49,13.72
  Bottom 0.254: v15.49,13.72 18.29,13.72 18.54,13.97 M1.CN3-9
N$5  (via drill 0.35)
  Top 0.254: R1.1 R9.2 v10.92,7.37
  Bottom 0.254: M1.CN2-10 18.54,7.1 18.27,7.37 v10.92,7.37
N$7
  Top 0.254: R2.1 R10.2 27.32,4.17 M1.CN2-17
N$8
  Top 0.254: IC2.1 25.53,9.66 R2.2 25.38,9.51 R6.1
N$9
  Top 0.254: IC3.1 34.42,9.66 R3.2 34.27,9.51 R7.1
N$10  (via drill 0.35)
  Top 0.254: R3.1 36.21,9.4 | 36.21,9.4 R11.2 | v37.59,9.65 37.34,9.4 36.21,9.4
  Bottom 0.254: M1.CN3-25 37.59,24.4 v37.59,9.65
N$11  (via drill 0.35)
  Top 0.254: R12.2 R4.1 v19.81,9.4
  Bottom 0.254: v19.81,9.4 19.81,26.67 20.07,26.92 25.91,26.92 26.16,27.18 M1.CN3-16
N$12
  Top 0.254: R8.1 16.49,9.26 R4.2 16.63,12 IC4.1
N$14
  Top 0.254: IC2.4 29.34,10.54 28.7,9.91 M1.CN2-18
N$15  (via drill 0.35)
  Top 0.254: v38.61,13.97 38.23,13.59 IC3.4
  Bottom 0.254: M1.CN3-26 40.64,26.43 40.64,14.22 40.39,13.97 v38.61,13.97
N$16  (via drill 0.35)
  Top 0.254: v21.59,11.43 21.03,11.43 IC4.4
  Bottom 0.254: M1.CN3-17 28.7,11.68 28.45,11.43 v21.59,11.43
N$17
  Top 0.508: Q10.2 103.38,46.18 BATT_3.+
  Top 1.27: Q8.3 98.76,51.05 101.86,47.96 BATT_3.+
N$18
  Top 0.508: Q11.2 99.3,24.57 103.38,28.65 BATT_4.+ 103.34,31.75
  Top 1.27: BATT_4.+ 103.34,31.75 102.83,32.26 Q9.3
N$19
  Top 0.508: Q8.1 98.09,42.04 Q10.3 R38.2
N$20
  Top 0.508: R39.2 94.81,22.35 Q11.3 97.2,22.66 98.35,23.8 Q9.1
N$22
  Top 0.508: Q10.1 99.57,40.44 99.57,39.12 99.31,38.86 R40.2 95.18,35.63 95.76,35.05 106.17,35.05 106.93,34.29 106.93,30.48 100.58,24.13 100.58,21.84 100.14,21.4 Q11.1
N$23
  Top 0.61: X8.1 97.28,13.97 96.52,13.97 95.18,15.31 R41.2 89.92,13.21 88.39,11.68 Q12.1
N$24  (via drill 0.35)
  Top 0.254: Q1.3 64.01,54.36 65.79,52.58 65.79,41.91 67.06,40.64 78.74,40.64 79.5,39.88 v79.5,35.05
  Bottom 0.254: v79.5,35.05 79.55,35 Q7.1
  Bottom 0.813: Q7.1 79.55,30.5 R43.2
N$25
  Top 0.508: R42.2 LED_PC.C
N$26
  Top 0.254: R44.2 LED_SERVO.C
N$27
  Bottom 0.813: R45.1 R46.2 90.27,14.5 IC6.4
N$28
  Bottom 0.813: IC6.2 86.94,19.35 D1.C 83.82,19.81 81.15,17.14 L1.2
N$29
  Top 1.27: U$3.P4 81.79,5.59 | Q12.4 72.14,14.22 71.63,14.73 71.37,14.73 70.87,14.22 71.12,13.97 73.41,13.97
  Top 1.524: 81.79,5.59 73.41,13.97
RE1  (via drill 0.35)
  Top 0.254: IC1.2 IC1.3 10.41,12.14 10.41,13.46 10.67,13.72 11.94,13.72 12.21,13.45 12.21,10.87 12.19,10.85 12.19,9.4 14.98,6.61 v15.04,6.61
  Bottom 0.254: v15.04,6.61 14.73,6.3 14.73,0.76 14.86,0.64 26.04,0.64 26.16,0.76 M1.CN2-15
RESET
  Top 0.254: X2.7 14.99,50.44 43.18,50.44 | 43.18,50.44 50,50.44 50.54,50.97 U$1.16 | X1.1 43.18,50.44
RO1
  Top 0.254: IC1.1 R1.2 5.85,9.4 R5.1
RX_3V3
  Bottom 0.254: U2.LV2 11.94,32.77 12.95,31.75 42.42,31.75 42.92,32.25 U$1.12
RX_5V
  Top 0.254: U2.HV2 11.94,45.47 13.08,44.32 IC5.1
SCL
  Top 0.254: U$2.SCL 67.06,32.77 66.04,31.75 48.68,31.75 48,32.43 U$1.14
SDA
  Top 0.254: U$1.11 40.38,31.76 41.15,30.99 68.58,30.99 69.85,32.26 69.85,38.86 U$2.SDA
STP
  Top 0.254: X2.2 27.69,54.36 28.19,54.86 39.12,54.86 40.64,56.39 40.64,57.7 U$1.20
STT
  Top 0.254: X2.1 41.91,52.58 42.93,53.59 42.93,57.96 U$1.19
TX_3V3
  Bottom 0.254: U2.LV1 9.4,32 10.41,30.99 44.45,30.99 45.46,31.99 U$1.13
TX_5V
  Top 0.254: IC5.4 10.29,40.51 9.4,41.4 U2.HV1
VCC  (via drill 0.35)  (1 unrouted)
  Top 0.254: R15.2 R22.2 31.1,21.73 31.5,21.34 31.5,20.83 | R19.2 R24.2 22.21,21.73 22.35,21.59 22.35,18.29 21.34,17.27 21.34,14.99 | 7.75,15.11 IC1.8 7.75,17.14 4.83,20.07 4.83,30.18 5.84,31.2 5.84,48.51 7.11,49.78 12.18,49.78 | 12.7,14.99 7.87,14.99 7.75,15.11 | 12.7,14.99 14.73,14.99 | 14.73,14.99 16.51,14.99 | 16.51,14.99 21.34,14.99 | 21.34,14.99 23.62,14.99 | 23.62,14.99 25.65,14.99 | 25.65,14.99 30.48,14.99 | 30.48,14.99 32.51,14.99 | 32.51,14.99 34.04,14.99 34.42,15.37 IC3.8 | 30.48,14.99 30.48,17.53 31.5,18.54 31.5,20.83 | 39.74,21.73 R23.2 R17.2 36.83,21.34 36.32,20.83 31.5,20.83 | 12.7,14.99 12.7,17.78 13.72,18.8 13.72,21.34 13.32,21.73 R21.2 R13.2 10.16,24.91 M1.CN3-3 M1.CN3-1 | IC4.8 16.64,15.11 16.51,14.99 | IC2.8 25.53,15.11 25.65,14.99 | R5.2 5.84,12.19 7.75,14.1 7.75,15.11 | R6.2 23.62,14.99 | R8.2 14.73,14.99 | R7.2 32.51,14.99 | U$1.30 12.18,55.17 12.18,49.78 | 14.47,49.78 14.47,47.76 U2.HV | R27.2 R25.2 37.34,42.93 38.1,43.69 38.1,45.72 37.34,46.48 35.94,46.48 35.56,46.86 35.56,48.26 35.05,48.77 33.78,48.77 33.53,48.51 33.53,44.96 32.89,44.32 IC5.8 30.61,44.32 25.15,49.78 14.47,49.78 | 12.18,49.78 14.47,49.78 | v51.31,51.05 51.04,50.79 51.04,50.76 48.26,47.98 X1.3
  Bottom 0.254: v51.31,51.05 51.31,54.86 51.44,54.99
  Bottom 0.61: U$2.VIN 79.5,41.4 87.31,41.4
  Bottom 0.813: L1.1 71.25,10.79 73.15,12.7 78.74,12.7 79.76,13.72 79.76,17.27 84.94,22.45 R45.2 84.94,28.3 87.12,30.48 87.88,30.48 | C6.+ 87.31,41.4 87.31,49.85 82.17,54.99 51.44,54.99 16.64,54.99 14.98,56.65 U$1.30
VCC_PC
  Top 1.27: U$3.P3 97.03,5.59 102.36,10.92 | PC1.+ 102.36,14.18 102.36,10.92 | LED_PC.A 105.63,10.92 102.36,10.92
VDD
  Top 0.254: J6.2 64.25,0.78 78.77,0.78 LED_SERVO.A
  Bottom 1.27: J3.2 J7.2 J4.2 48.51,4.83 | 48.51,4.83 J8.2 | 62.74,4.83 J2.2 J5.2 J1.2 62.74,26.16 61.82,27.08 U$4.P3 | 62.74,4.83 J6.2 | 62.74,4.83 48.51,4.83

### Text on the board
tPlace: BUS 3 | BUS 1 | BUS 4 | BUS 2
tNames: Powerswitch | Dynamixel Controller
bNames: Dynamixel Motor Controller / Designed by Andreas and Zidane